# Altium project pca20053.PrjPCB (part 2 of 4)

## Sheet pca20053_sheet5_sensors_and_leds.SchDoc: Thingy:53 Sensors and LEDs
size A3; Organization: Nordic Semiconductor; DocumentNumber: 5; Revision: 1.1.0; SheetNumber: 5; SheetTotal: 6; Author: MASI; CompanyName: Nordic Semiconductor; DrawnBy: MASI; DocumentSize: A3; ProjectName: Thingy:53
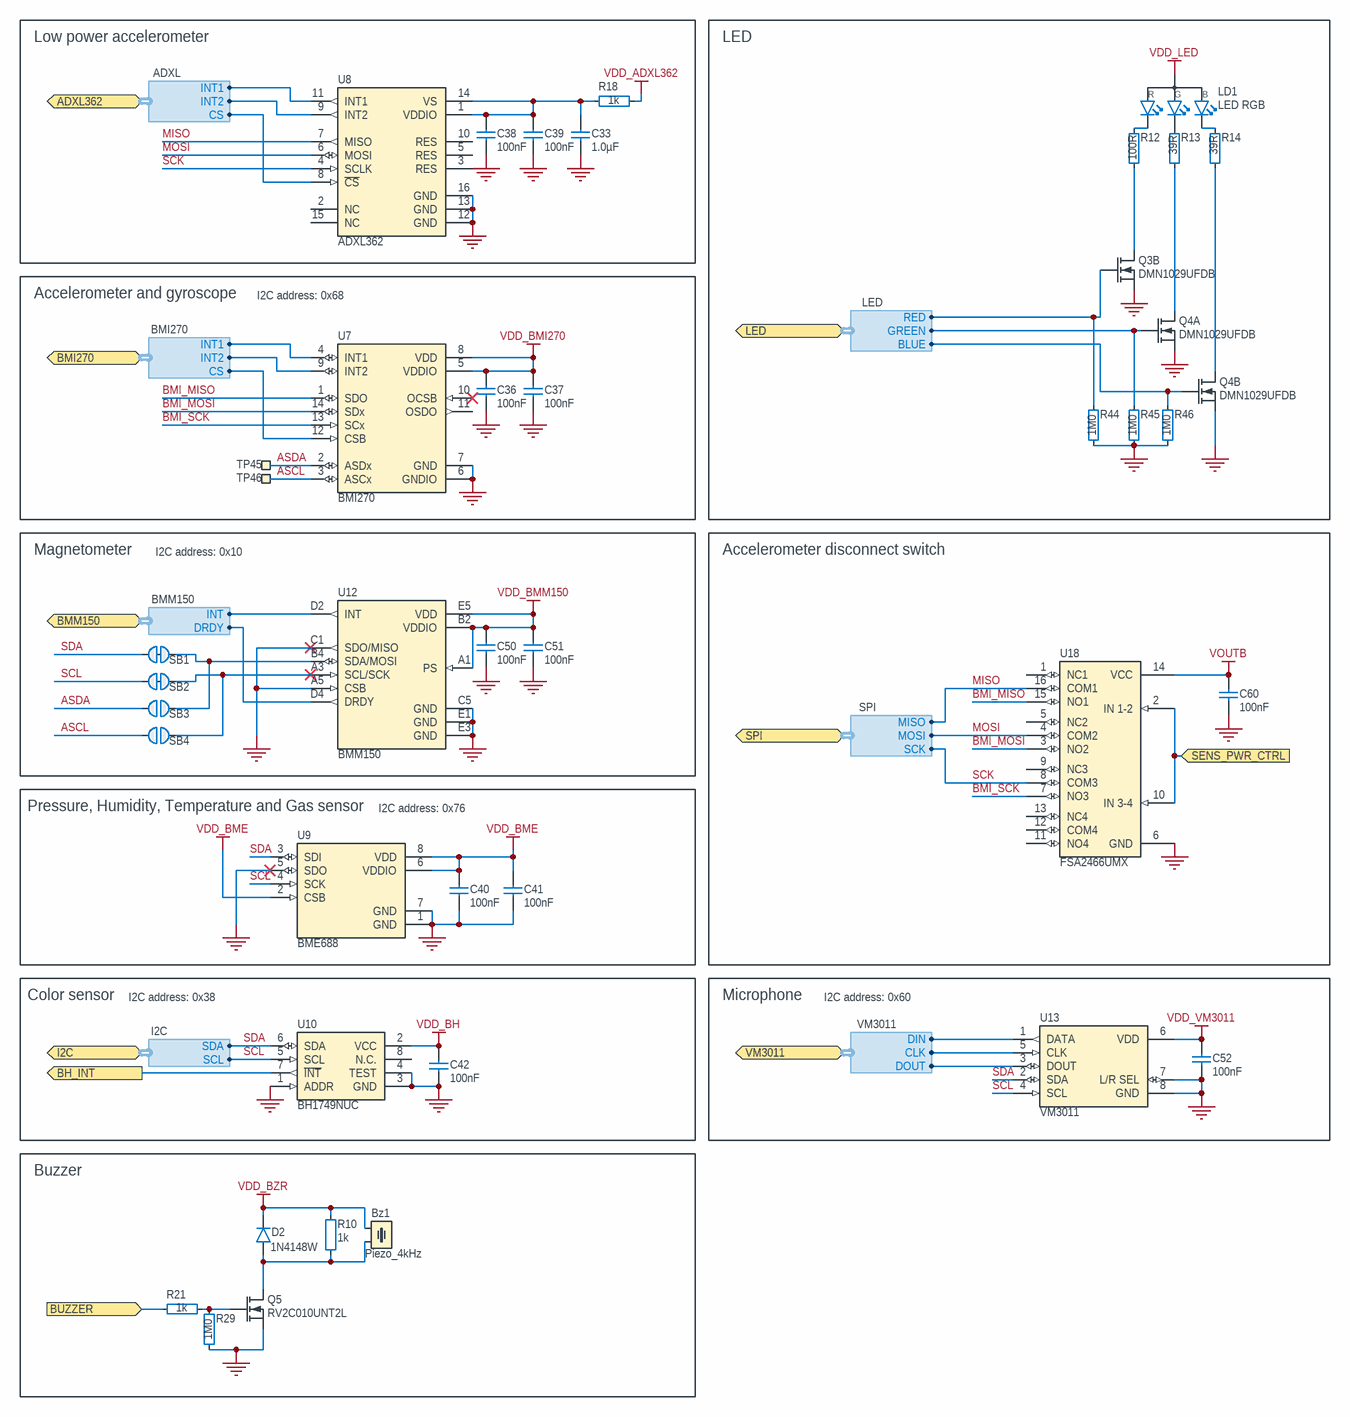
[diagram p2: pca20053_sheet5_sensors_and_leds.SchDoc]

### Parts
Bz1  Piezo_4kHz  [Buzzer_PKMCS0909]
C33  1.0µF  [CAPC1005X04L]
C36  100nF  [CAPC0603X03L_C]
C37  100nF  [CAPC0603X03L_C]
C38  100nF  [CAPC0603X03L_C]
C39  100nF  [CAPC0603X03L_C]
C40  100nF  [CAPC0603X03L_C]
C41  100nF  [CAPC0603X03L_C]
C42  100nF  [CAPC0603X03L_C]
C50  100nF  [CAPC0603X03L_C]
C51  100nF  [CAPC0603X03L_C]
C52  100nF  [CAPC0603X03L_C]
C60  100nF  [CAPC0603X03L_C]
D2  1N4148W  [SOD-123-DIODE]
LD1  LED RGB  [LED_RGB_0606]
Q3  DMN1029UFDB  [DFN65P200X60_HS-6N]  (part B of 2)
Q4  DMN1029UFDB  [DFN65P200X60_HS-6N]  (parts A,B of 2)
Q5  RV2C010UNT2L  [DFN65P100X40-3L]
R10  1k  [RESC0603X03L_C]
R12  100R  [RESC0603X03L_C]
R13  39R  [RESC0603X03L_C]
R14  39R  [RESC0603X03L_C]
R18  1k  [RESC0603X03L_C]
R21  1k  [RESC0603X03L_C]
R29  1M0  [RESC0603X03L_C]
R44  1M0  [RESC0603X03L_C]
R45  1M0  [RESC0603X03L_C]
R46  1M0  [RESC0603X03L_C]
SB1  Solderbridge  [Solderbridge_Shorted]  (value not drawn)  (net tie, no BOM)
SB2  Solderbridge  [Solderbridge_Shorted]  (value not drawn)  (net tie, no BOM)
SB3  Solderbridge  [Solderbridge]  (value not drawn)  (no BOM)
SB4  Solderbridge  [Solderbridge]  (value not drawn)  (no BOM)
TP45  Ø0.7mm,SMD  [TP_SMD_D0.7mm]  (value not drawn)  (no BOM)
TP46  Ø0.7mm,SMD  [TP_SMD_D0.7mm]  (value not drawn)  (no BOM)
U7  BMI270  [BMI270]
U8  ADXL362  [LGA50P322X300X114-16N]
U9  BME688  [BME680]
U10  BH1749NUC  [WSON50P210X210X60_HS-9N]
U12  BMM150  [BMM150]
U13  VM3011  [VM3011]
U18  FSA2466UMX  [XQFN40P180X260X50-16N]

### Blocks framed on the sheet
Low power accelerometer: C33 C38 C39 R18 U8
LED: LD1 Q3 Q4 R12-R14 R44-R46
Accelerometer and gyroscope: C36 C37 TP45 TP46 U7
Magnetometer: C50 C51 SB1-SB4 U12
Accelerometer disconnect switch: C60 U18
Pressure, Humidity, Temperature and Gas sensor: C40 C41 U9
Color sensor: C42 U10
Microphone: C52 U13
Buzzer: Bz1 D2 Q5 R10 R21 R29

### Ports
ADXL362 (bidir, harness ADXL), BH_INT (out), BMI270 (bidir, harness BMI270), BMM150 (bidir, harness BMM150), BUZZER (in), I2C (bidir, harness I2C), LED (bidir, harness LED), SENS_PWR_CTRL (in), SPI (bidir, harness SPI), VM3011 (bidir, harness VM3011)

### Harnesses
I2C: SDA, SCL
LED: BLUE, GREEN, RED
BMI270: CS, INT2, INT1
ADXL: CS, INT2, INT1
BMM150: DRDY, INT
VM3011: DIN, CLK, DOUT
SPI: MISO, MOSI, SCK

### Nets
GND: C33.1 C36.1 C37.1 C38.1 C39.1 C40.1 C41.1 C42.1 C50.1 C51.1 C52.1 C60.2 Q3.4(S2) Q4.1(S1) Q4.4(S2) Q5.2(S) R29.1 R44.1 R45.1 R46.1 U7.6(GNDIO) U7.7(GND) U8.12(GND) U8.13(GND) U8.16(GND) U9.1(GND) U9.5(SDO) U9.7(GND) U10.1(ADDR) U10.3(GND) U10.4(TEST) U10.9(GND) U12.A5(CSB) U12.C1(SDO/MISO) U12.C5(GND) U12.E1(GND) U12.E3(GND) U13.7(L/R_SEL) U13.8(GND) U18.6(GND)
VDD_ADXL362: R18.1
VDD_BH: C42.2 U10.2(VCC)
VDD_BME: C40.2 C41.2 U9.2(CSB) U9.6(VDDIO) U9.8(VDD)
VDD_BMI270: C36.2 C37.2 U7.5(VDDIO) U7.8(VDD)
VDD_BMM150: C50.2 C51.2 U12.A1(PS) U12.B2(VDDIO) U12.E5(VDD)
VDD_BZR: Bz1.1 D2.1(C) R10.2
VDD_LED: LD1.4(A)  [project net 3V3]
VDD_VM3011: C52.2 U13.6(VDD)
VOUTB: C60.1 U18.14(VCC)
ASCL: SB4.1 TP46.1 U7.3(ASCx)
ASDA: SB3.1 TP45.1 U7.2(ASDx)
BMI_MISO: U7.1(SDO) U18.15(NO1)
BMI_MOSI: U7.14(SDx) U18.3(NO2)
BMI_SCK: U7.13(SCx) U18.7(NO3)
MISO: U8.7(MISO) U18.16(COM1) ; port SPI.MISO
MOSI: U8.6(MOSI) U18.4(COM2) ; port SPI.MOSI
P0.19: U8.11(INT1) ; port ADXL362.INT1
P0.20: U12.D2(INT) ; port BMM150.INT
P0.21: U12.D4(DRDY) ; port BMM150.DRDY
P0.22: U8.8(~{CS}) ; port ADXL362.CS
P0.23: U7.4(INT1) ; port BMI270.INT1
P0.25/AIN4: U13.3(DOUT) ; port VM3011.DOUT
P0.27/AIN6: U13.1(DATA) ; port VM3011.DIN
P0.31: U18.2(IN_1-2) U18.10(IN_3-4) ; port SENS_PWR_CTRL
P1.04: U7.12(CSB) ; port BMI270.CS
P1.05: U10.7(~{INT}) ; port BH_INT
P1.06: Q4.2(G1) R45.2 ; port LED.GREEN
P1.07: Q4.5(G2) R46.2 ; port LED.BLUE
P1.08: Q3.5(G2) R44.2 ; port LED.RED
P1.09: U13.5(CLK) ; port VM3011.CLK
P1.15: R21.1 ; port BUZZER
SCK: U8.4(SCLK) U18.8(COM3) ; port SPI.SCK  [project net P0.29]
SCL: SB2.2 U9.4(SCK) U10.5(SCL) U13.4(SCL) ; port I2C.SCL  [project net P1.03]
SDA: SB1.2 U9.3(SDI) U10.6(SDA) U13.2(SDA) ; port I2C.SDA  [project net P1.02]
NetBz1_2: Bz1.2 D2.2(A) Q5.3(D) R10.1
NetC33_2: C33.2 C38.2 C39.2 R18.2 U8.1(VDDIO) U8.14(VS)
NetLD1_1: LD1.1(C_RED) R12.2
NetLD1_2: LD1.2(C_GREEN) R13.2
NetLD1_3: LD1.3(C_BLUE) R14.2
NetQ3_3: Q3.3(D2) R12.1
NetQ4_3: Q4.3(D2) R14.1
NetQ4_6: Q4.6(D1) R13.1
NetQ5_1: Q5.1(G) R21.2 R29.2
NetSB1_1: SB1.1 SB3.2 U12.B4(SDA/MOSI)
NetSB2_1: SB2.1 SB4.2 U12.A3(SCL/SCK)
NetU7_9: U7.9(INT2) ; port BMI270.INT2
NetU8_9: U8.9(INT2) ; port ADXL362.INT2

Not connected (* = marked no-connect by the designer): U7 10(OCSB)* 11(OSDO); U8 2(NC) 3(RES) 5(RES) 10(RES) 15(NC); U10 8(N.C.); U18 1(NC1) 5(NC2) 9(NC3) 11(NO4) 12(COM4) 13(NC4)

### Notes on the sheet
- I2C address: 0x68
- I2C address: 0x10
- (near U9) I2C address: 0x76
- I2C address: 0x38
- I2C address: 0x60
- Title
- Size
- Date:
- File:
- A3
- PCB Assembly Number
- Sheet         of
- Drawn By:
- Revision
- Classification:
- (in symbol LTST-C19HE1WT) R; G; B

### Library data of the parts
Bz1 = PKMCS0909E4000-R1: Piezo Buzzer, SMD, 9.0mm x 9.0mm x 1.9mm, 4kHz, 65dB @ 1.5V, <12.5Vp-p; Manufacturer: Murata; Part number NEMS: 101000026; Note: 1.5 ~ 12.5V; Artikkelnr Noca: N.A.; Pad Count: 2; Component Status: Active; Part Number: PKMCS0909E4000-R1; Manufacturer Part Number: PKMCS0909E4000-R1; ComponentLink1URL: N.A.; ComponentLink1Description: Datasheet; ComponentLink2URL: N.A.; ComponentLink2Description: Supplier link; HelpURL: https://www.murata.com/en-global/products/productdetail.aspx?partno=PKMCS0909E4000-R1; Footprint Doc: Buzzer_PKMCS0909; LatestRevisionDate: 2020-08-04; Published: 2020-08-04; Value: Piezo_4kHz; Supplier 1: Digi-Key; Supplier Part Number 1: 490-9647-1-ND; Supplier 2: Mouser; Supplier Part Number 2: 81-PKMCS0909E4000-R1; Part number IPS: N.A.; Component Class: Transducers; PartId: 101000026; Author: rsk; Part number Norautron: N.A.
C33 = C0402-1µ0-25V-X5R: Capacitor, Ceramic, X5R, ±10%, 25V; Manufacturer: Murata; Manufacturer Part Number: GRM155R61E105KA12D; Part number NEMS: 100200453; Artikkelnr Noca: N.A.; Pad Count: 2; Component Status: Active; Part Number: C0402-1µ0-25V-X5R; LatestRevisionDate: 2020-12-16; Published: 2020-12-16; Value: 1.0µF; Footprint Doc: 0402; Component Class: Capacitors; ComponentLink1Description: Datasheet; ComponentLink1URL: https://search.murata.co.jp/Ceramy/image/img/A01X/G101/ENG/GRM155R61E105KA12-01.pdf; ComponentLink2Description: Supplier link; ComponentLink2URL: https://www.murata.com/en-global/products/productdetail?partno=GRM155R61E105KA12%23; HelpURL: N.A.; Note: 25V; PartId: 100200453; Part number IPS: N.A.; Supplier 1: Digi-Key; Supplier 2: Mouser; Supplier Part Number 1: 490-10017-1-ND; Supplier Part Number 2: 81-GRM155R61E105KA2D; Author: rsk; Part number Norautron: N.A.
C36-C42 C50-C52 C60 = C0201-100n-6.3V-X5R: Capacitor, Ceramic, X5R, ±10%, 6.3V; Manufacturer: Murata; Manufacturer Part Number: GRM033R60J104KE19D; Part number NEMS: 100200451; Artikkelnr Noca: N.A.; Pad Count: 2; Component Status: Active; Part Number: C0201-100n-6.3V-X5R; Footprint Doc: 0201; LatestRevisionDate: 2020-12-15; Published: 2020-12-15; Value: 100nF; Note: 6.3V; Part number IPS: N.A.; ComponentLink1URL: https://search.murata.co.jp/Ceramy/image/img/A01X/G101/ENG/GRM033R60J104KE19-01.pdf; ComponentLink1Description: Datasheet; ComponentLink2URL: https://www.murata.com/en-eu/products/productdetail?partno=GRM033R60J104KE19%23; ComponentLink2Description: Supplier link; HelpURL: N.A.; Supplier 1: Digi-Key; Supplier Part Number 1: 490-3167-1-ND; Supplier 2: N.A.; Supplier Part Number 2: N.A.; Component Class: Capacitors; PartId: 100200451; Author: rsk; Part number Norautron: N.A.
D2 = 1N4148W: 1N4148, Small Signal Fast Switching Diode; Manufacturer: Vishay; Manufacturer Part Number: 1N4148W-E3-08; Part number IPS: 00000001783; Part number NEMS: 101300078; Artikkelnr Noca: N.A.; Pad Count: 2; Component Status: Active; Part Number: 1N4148W; ComponentLink1URL: N.A.; ComponentLink1Description: Datasheet; ComponentLink2URL: N.A.; ComponentLink2Description: Supplier link; HelpURL: http://www.vishay.com/docs/85748/1n4148w.pdf; Footprint Doc: SOD-123; LatestRevisionDate: 2016-01-12; Published: 2011-04-21; Value: 1N4148W; Note: Small Signal Fast Switching Diode; Supplier 1: Farnell; Supplier Part Number 1: 237-7282; Supplier 2: Digi-Key; Supplier Part Number 2: 1N4148W-E3-08CT-ND; Component Class: Semiconductors; PartId: 101300078; Author: rsk; Part number Norautron: N.A.
LD1 = LTST-C19HE1WT: RGB LED 1.60 mm x 1.60 mm SMD; Manufacturer: LITEON; Part number IPS: 00000007798; Part number NEMS: 101400093; Note: N.A.; Pad Count: 4; Component Status: Active; Part Number: LTST-C19HE1WT; Manufacturer Part Number: LTST-C19HE1WT; LatestRevisionDate: 2016-09-23; Published: 2016-09-23; Value: LED RGB; Artikkelnr Noca: N.A.; Footprint Doc: LED_RGB_0606; ComponentLink1URL: N.A.; ComponentLink1Description: Datasheet; ComponentLink2URL: N.A.; ComponentLink2Description: Supplier link; HelpURL: http://optoelectronics.liteon.com/upload/download/DS22-2008-0044/S_110_LTST-C19HE1WT.pdf; Supplier 1: Digi-Key; Supplier Part Number 1: 160-2162-1-ND; Supplier 2: Mouser; Supplier Part Number 2: 859-LTST-C19HE1WT; Component Class: Optoelectronics; PartId: 101400093; Author: rsk; Part number Norautron: N.A.
Q3 Q4 = DMN1029UFDB: Dual N Ch MOFET, 5.6A, 29mOhm @ 5A, 4.5V, 1.4W; Manufacturer: Diodes Incorporated; Manufacturer Part Number: DMN1029UFDB-7; Part number NEMS: 101300175; Note: N.A.; Pad Count: 6; Component Status: Active; Part Number: DMN1029UFDB; Footprint Doc: DFN-6; LatestRevisionDate: 2020-04-29; Published: 2020-04-29; Value: DMN1029UFDB; Artikkelnr Noca: N.A.; Part number IPS: N.A.; Supplier 1: Digi-Key; Supplier Part Number 1: DMN1029UFDB-7DICT-ND; Supplier 2: Mouser; Supplier Part Number 2: 621-DMN1029UFDB-7; ComponentLink1URL: https://www.diodes.com/assets/Datasheets/DMN1029UFDB.pdf; ComponentLink1Description: Datasheet; ComponentLink2URL: N.A.; ComponentLink2Description: Supplier link; HelpURL: https://www.diodes.com/assets/Datasheets/DMN1029UFDB.pdf; Component Class: Semiconductors; PartId: 101300175; Author: rsk; Part number Norautron: N.A.
Q5 = RV2C010UNT2L: N-Channel MOSFET, 20V, 1A, 470mOhm, 400mW; Manufacturer: Rohm Semiconductor; Part number IPS: 00000009976; Part number Norautron: 26320026; Part number NEMS: 101300132; Note: N.A.; Artikkelnr Noca: 35010020; Pad Count: 3; Component Status: Active; Part Number: RV2C010UNT2L; Manufacturer Part Number: RV2C010UNT2L; Footprint Doc: DFN-3; LatestRevisionDate: 2016-08-09; Published: 2016-08-09; Value: RV2C010UNT2L; ComponentLink1URL: N.A.; ComponentLink1Description: Datasheet; ComponentLink2URL: N.A.; ComponentLink2Description: Supplier link; HelpURL: http://rohmfs.rohm.com/en/products/databook/datasheet/discrete/transistor/mosfet/rv2c010unt2l-e.pdf; Supplier 1: Digi-Key; Supplier Part Number 1: RV2C010UNT2LCT-ND; Supplier 2: Mouser; Supplier Part Number 2: 755-RV2C010UNT2L; Component Class: Semiconductors; PartId: 101300132; Author: rsk
R10 R18 R21 = R0201-1k0: Resistor, ±1%, 0.05W; Manufacturer: N.A.; Part number IPS: 00000005786; Part number NEMS: 100100043; Note: Chip Res 1%; Pad Count: 2; Component Status: Active; Part Number: R0201-1k0; Manufacturer Part Number: N.A.; ComponentLink1URL: N.A.; ComponentLink1Description: Datasheet; ComponentLink2URL: N.A.; ComponentLink2Description: Supplier link; HelpURL: N.A.; Footprint Doc: 0201; LatestRevisionDate: 2014-11-13; Published: 2014-11-13; Value: 1k; Supplier 1: N.A.; Supplier Part Number 1: N.A.; Supplier 2: N.A.; Supplier Part Number 2: N.A.; Artikkelnr Noca: N.A.; Component Class: Resistors; PartId: 100100043; Author: rsk; Part number Norautron: N.A.
R12 = R0201-100: Resistor, ±1%, 0.05W; Manufacturer: N.A.; Part number IPS: 00000001794; Part number Norautron: 26107004; Part number NEMS: 100100027; Note: Chip Res 1%; Pad Count: 2; Component Status: Active; Part Number: R0201-100; Manufacturer Part Number: N.A.; LatestRevisionDate: 2014-11-13; Published: 2014-11-13; Value: 100R; Artikkelnr Noca: N.A.; Footprint Doc: 0201; ComponentLink1URL: N.A.; ComponentLink1Description: Datasheet; ComponentLink2URL: N.A.; ComponentLink2Description: Supplier link; HelpURL: N.A.; Supplier 1: N.A.; Supplier Part Number 1: N.A.; Supplier 2: N.A.; Supplier Part Number 2: N.A.; Component Class: Resistors; PartId: 100100027; Author: rsk
R13 R14 = R0201-39R: Resistor, ±1%, 0.05W; Manufacturer: N.A.; Part number IPS: 00000001704; Part number NEMS: 100100021; Note: Chip Res 1%; Pad Count: 2; Component Status: Active; Part Number: R0201-39R; Manufacturer Part Number: N.A.; LatestRevisionDate: 2014-11-13; Published: 2014-11-13; Value: 39R; Artikkelnr Noca: N.A.; Footprint Doc: 0201; ComponentLink1URL: N.A.; ComponentLink1Description: Datasheet; ComponentLink2URL: N.A.; ComponentLink2Description: Supplier link; HelpURL: N.A.; Supplier 1: N.A.; Supplier Part Number 1: N.A.; Supplier 2: N.A.; Supplier Part Number 2: N.A.; Component Class: Resistors; PartId: 100100021; Author: rsk; Part number Norautron: N.A.
R29 = R0201-1M0: Resistor, ±1%, 0.05W; Manufacturer: N.A.; Part number IPS: 00000001418; Part number Norautron: 26107108; Part number NEMS: 100100093; Pad Count: 2; Note: Chip Res 1%; Component Status: Active; Part Number: R0201-1M0; PartId: 100100093; Component Class: Resistors; Manufacturer Part Number: N.A.; ComponentLink1URL: N.A.; ComponentLink1Description: Datasheet; ComponentLink2URL: N.A.; ComponentLink2Description: Supplier link; HelpURL: N.A.; Footprint Doc: 0201; LatestRevisionDate: 2014-11-13; Published: 2014-11-13; Value: 1M0; Supplier 1: N.A.; Supplier Part Number 1: N.A.; Supplier 2: N.A.; Supplier Part Number 2: N.A.; Artikkelnr Noca: N.A.; Author: rsk
R44-R46 = R0201-1M0: Resistor, ±1%, 0.05W; Manufacturer: N.A.; Part number IPS: 00000001418; Part number Norautron: 26107108; Part number NEMS: 100100093; Note: Chip Res 1%; Pad Count: 2; Component Status: Active; Part Number: R0201-1M0; Manufacturer Part Number: N.A.; LatestRevisionDate: 2014-11-13; Published: 2014-11-13; Value: 1M0; Artikkelnr Noca: N.A.; Footprint Doc: 0201; ComponentLink1URL: N.A.; ComponentLink1Description: Datasheet; ComponentLink2URL: N.A.; ComponentLink2Description: Supplier link; HelpURL: N.A.; Supplier 1: N.A.; Supplier Part Number 1: N.A.; Supplier 2: N.A.; Supplier Part Number 2: N.A.; Component Class: Resistors; PartId: 100100093; Author: rsk
SB1 SB2 = Solderbridge Shorted: Shorted Solderbridge; Manufacturer: N.A.; Part number NEMS: 100500459; Pad Count: 2; Component Status: Active; System: Connector; Part Number: Solderbridge Shorted; PartId: 100500459; Component Class: Connectors; Manufacturer Part Number: N.A.; ComponentLink1URL: N.A.; ComponentLink1Description: Datasheet; ComponentLink2URL: N.A.; ComponentLink2Description: Supplier link; HelpURL: N.A.; Footprint Doc: Solderbridge_Shorted; LatestRevisionDate: 2012-08-07; Published: 2012-08-07; Value: Solderbridge; Note: N.A.; Supplier 1: N.A.; Supplier Part Number 1: N.A.; Supplier 2: N.A.; Supplier Part Number 2: N.A.; Artikkelnr Noca: N.A.; Part number IPS: N.A.; Author: rsk; Part number Norautron: N.A.
SB3 SB4 = Solderbridge: Manufacturer: N.A.; Part number NEMS: 100500458; Pad Count: 2; Component Status: Active; System: Connector; Part Number: Solderbridge; PartId: 100500458; Component Class: Connectors; Manufacturer Part Number: N.A.; ComponentLink1URL: N.A.; ComponentLink1Description: Datasheet; ComponentLink2URL: N.A.; ComponentLink2Description: Supplier link; HelpURL: N.A.; Footprint Doc: Solderbridge; LatestRevisionDate: 2009-12-14; Published: 2009-12-14; Value: Solderbridge; Note: N.A.; Supplier 1: N.A.; Supplier Part Number 1: N.A.; Supplier 2: N.A.; Supplier Part Number 2: N.A.; Artikkelnr Noca: N.A.; Part number IPS: N.A.; Author: rsk; Part number Norautron: N.A.
TP45 TP46 = TP_SMD_Ø0.7MM: 0.7mm circular SMD testpad; Manufacturer: Nordic Semiconductor; Manufacturer Part Number: N.A.; Part number NEMS: 100500474; Pad Count: 1; Component Status: Active; System: Connector; Part Number: TP_SMD_Ø0.7MM; PartId: 100500474; Component Class: Connectors; ComponentLink1URL: N.A.; ComponentLink1Description: Datasheet; ComponentLink2URL: N.A.; ComponentLink2Description: Supplier link; HelpURL: N.A.; Footprint Doc: TP_SMD_Ø0.7mm; LatestRevisionDate: 2021-03-05; Published: 2017-12-14; Value: Ø0.7mm,SMD; Note: N.A.; Supplier 1: N.A.; Supplier Part Number 1: N.A.; Supplier 2: N.A.; Supplier Part Number 2: N.A.; Artikkelnr Noca: N.A.; Part number IPS: N.A.; Author: rsk; Part number Norautron: N.A.
U7 = BMI270: 6-axis, smart, low-power, inertial measurement unit; Manufacturer: Bosch; Part number NEMS: 101900620; Note: N.A.; Pad Count: 14; Component Status: Active; Part Number: BMI270; Manufacturer Part Number: BMI270; ComponentLink1URL: https://www.bosch-sensortec.com/media/boschsensortec/downloads/datasheets/bst-bmi270-ds000.pdf; ComponentLink1Description: Datasheet; ComponentLink2URL: https://www.bosch-sensortec.com/products/motion-sensors/imus/bmi270.html; ComponentLink2Description: Supplier link; HelpURL: https://www.bosch-sensortec.com/media/boschsensortec/downloads/datasheets/bst-bmi270-ds000.pdf; Footprint Doc: LGA-14; LatestRevisionDate: 2021-08-03; Published: 2020-07-07; Value: BMI270; Supplier 1: Digi-Key; Supplier Part Number 1: 828-1091-1-ND; Supplier 2: Mouser; Supplier Part Number 2: 262-BMI270; Artikkelnr Noca: N.A.; Part number IPS: N.A.; Component Class: Misc_ICs; PartId: 101900620; Author: rsk; Part number Norautron: N.A.
U8 = ADXL362: Micropower, 3-Axis, ±2 g/±4 g/±8 g Digital Output MEMS Accelerometer; Manufacturer: Analog Devices; Part number IPS: 00000001799; Part number NEMS: 101900573; Note: N.A.; Pad Count: 16; Component Status: Active; Part Number: ADXL362; Manufacturer Part Number: ADXL362; ComponentLink1URL: http://www.analog.com/media/en/technical-documentation/data-sheets/ADXL362.pdf; ComponentLink1Description: Datasheet; ComponentLink2URL: http://www.analog.com/en/products/adxl362.html; ComponentLink2Description: Supplier link; HelpURL: https://www.analog.com/media/en/technical-documentation/data-sheets/ADXL362.pdf; Footprint Doc: LGA-16; LatestRevisionDate: 2019-01-11; Published: 2019-01-11; Value: ADXL362; Supplier 1: Digi-Key; Supplier Part Number 1: ADXL362BCCZ-RL7CT-ND; Supplier 2: Mouser; Supplier Part Number 2: 584-ADXL362BCCZ-R7; Artikkelnr Noca: N.A.; Component Class: Misc_ICs; PartId: 101900573; Author: rsk; Part number Norautron: N.A.
U9 = BME688: Low power gas, pressure, temperature & humidity sensor; Manufacturer: Bosch; Part number NEMS: 101900619; Note: N.A.; Pad Count: 8; Component Status: Active; Part Number: BME688; Manufacturer Part Number: BME688; Footprint Doc: LGA-8; LatestRevisionDate: 2020-07-07; Published: 2020-07-07; Value: BME688; Artikkelnr Noca: N.A.; Part number IPS: N.A.; ComponentLink1URL: https://ae-bst.resource.bosch.com/media/_tech/media/datasheets/BST-BME680-DS001-00.pdf; ComponentLink1Description: Datasheet; ComponentLink2Description: Supplier link; HelpURL: N.A.; Supplier 1: Digi-Key; Supplier Part Number 1: N.A.; Supplier 2: N.A.; Supplier Part Number 2: N.A.; Component Class: Misc_ICs; ComponentLink2URL: N.A.; PartId: 101900619; Author: rsk; Part number Norautron: N.A.
U10 = BH1749NUC: Digital 16bit Serial Output Type Color Sensor IC; Manufacturer: Rohm Semiconductor; Part number IPS: 00000001801; Part number NEMS: 101900572; Note: N.A.; Pad Count: 8; Component Status: Active; Part Number: BH1749NUC; Manufacturer Part Number: BH1749NUC; Footprint Doc: WSON-8; LatestRevisionDate: 2019-01-11; Published: 2019-01-11; Value: BH1749NUC; Artikkelnr Noca: N.A.; ComponentLink1URL: N.A.; ComponentLink1Description: Datasheet; ComponentLink2URL: N.A.; ComponentLink2Description: Supplier link; HelpURL: https://www.rohm.com/datasheet/BH1749NUC/bh1749nuc-e; Supplier 1: Digi-Key; Supplier Part Number 1: BH1749NUC-E2CT-ND; Supplier 2: Mouser; Supplier Part Number 2: 755-BH1749NUC-E2; Component Class: Misc_ICs; PartId: 101900572; Author: rsk; Part number Norautron: N.A.
U12 = BMM150: 3-axis geomagnetic sensor; Manufacturer: Bosch; Part number NEMS: 101900621; Note: N.A.; Pad Count: 12; Component Status: Active; Part Number: BMM150; Manufacturer Part Number: BMM150; ComponentLink1URL: https://www.bosch-sensortec.com/media/boschsensortec/downloads/datasheets/bst-bmm150-ds001.pdf; ComponentLink1Description: Datasheet; ComponentLink2URL: https://www.bosch-sensortec.com/products/motion-sensors/magnetometers-bmm150/; ComponentLink2Description: Supplier link; HelpURL: https://www.bosch-sensortec.com/media/boschsensortec/downloads/datasheets/bst-bmm150-ds001.pdf; Footprint Doc: WLCSP-12; LatestRevisionDate: 2020-07-07; Published: 2020-07-07; Value: BMM150; Supplier 1: Digi-Key; Supplier Part Number 1: 828-1044-1-ND; Supplier 2: Mouser; Supplier Part Number 2: 262-BMM150; Artikkelnr Noca: N.A.; Part number IPS: N.A.; Component Class: Misc_ICs; PartId: 101900621; Author: rsk; Part number Norautron: N.A.
U13 = VM3011AB: Low-Noise PDM Digital Piezoelectric MEMS Microphone with ZeroPower Listening; Manufacturer: Vesper; Part number Norautron: 26470039; Part number NEMS: 101900623; Component Status: Active; Pad Count: 8; Note: N.A.; Part Number: VM3011AB; PartId: 101900768; Component Class: Misc_ICs; Author: rsk; Manufacturer Part Number: VM3011AB; ComponentLink1URL: N.A.; ComponentLink1Description: Datasheet; ComponentLink2URL: N.A.; ComponentLink2Description: Supplier link; HelpURL: N.A.; LatestRevisionDate: 2022-02-02; Published: 2020-02-02; Footprint Doc: VM3011; Value: VM3011; Supplier 1: Digi-Key; Supplier Part Number 1: N.A.; Supplier 2: N.A.; Supplier Part Number 2: N.A.; Artikkelnr Noca: N.A.; Part number IPS: N.A.
U18 = FSA2466UMX: Data / Audio Low-Voltage Dual DPDT Analog Switch; Manufacturer: ON Semiconductor; Part number IPS: 00000009986; Part number Norautron: 26500608; Part number NEMS: 101900422; Note: N.A.; Artikkelnr Noca: 15070069; Pad Count: 16; Component Status: Active; Part Number: FSA2466UMX; Manufacturer Part Number: FSA2466UMX; ComponentLink1URL: N.A.; ComponentLink1Description: Datasheet; ComponentLink2URL: N.A.; ComponentLink2Description: Supplier link; HelpURL: https://www.onsemi.com/pub/Collateral/FSA2466-D.PDF; Footprint Doc: UFQFN-16; LatestRevisionDate: 2019-05-15; Published: 2016-05-18; Value: FSA2466UMX; Supplier 1: Digi-Key; Supplier Part Number 1: FSA2466UMXCT-ND; Supplier 2: Mouser; Supplier Part Number 2: 512-FSA2466UMX; Component Class: Misc_ICs; PartId: 101900422; Author: rsk

## Sheet pca20053_sheet3_nRF21540_FEM.SchDoc: Thingy:53 nRF21540 Front-end module
size A3; Organization: Nordic Semiconductor; DocumentNumber: 3; Revision: 1.1.0; SheetNumber: 3; SheetTotal: 6; Author: MASI; CompanyName: Nordic Semiconductor; DrawnBy: MASI; DocumentSize: A3; ProjectName: Thingy:53
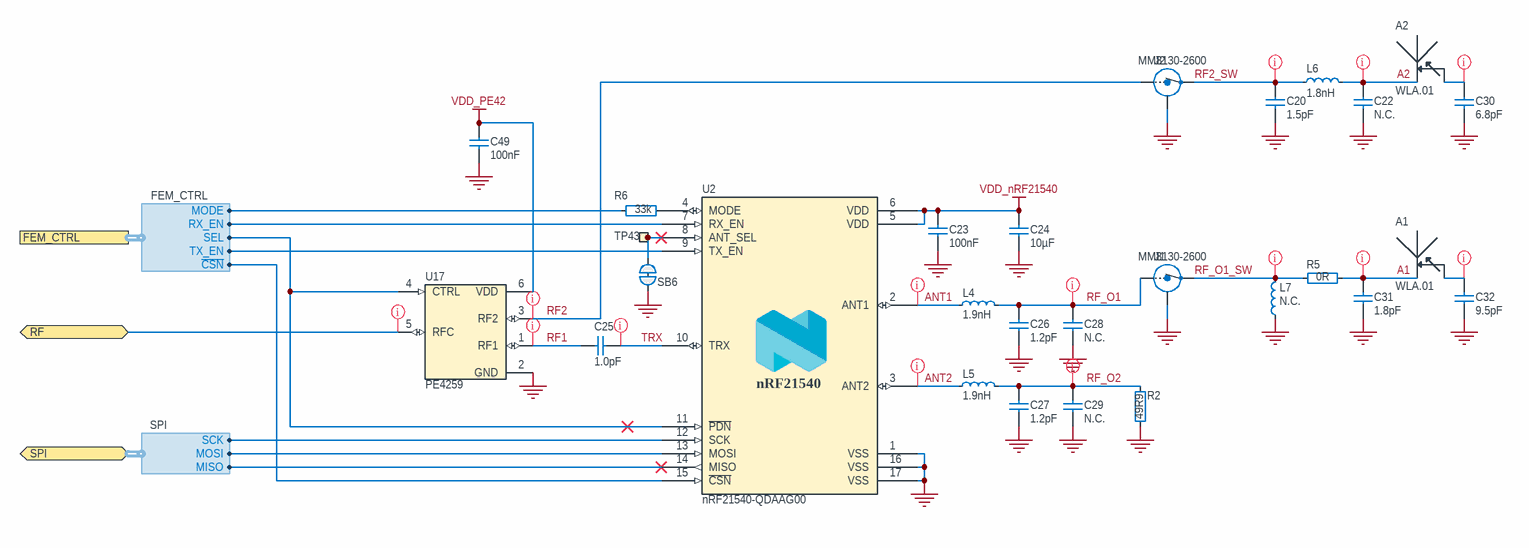
[diagram p3: pca20053_sheet3_nRF21540_FEM.SchDoc]

### Parts
A1  WLA.01  [WLA.01]
A2  WLA.01  [WLA.01]
C20  1.5pF  [CAPC0603X03L_C]
C22  N.C.  [CAPC0603X03L_C_NC]
C23  100nF  [CAPC0603X03L_C]
C24  10µF  [CAPC1608X06L]
C25  1.0pF  [CAPC0603X03L_C]
C26  1.2pF  [CAPC0603X03L_C]
C27  1.2pF  [CAPC0603X03L_C]
C28  N.C.  [CAPC0603X03L_C_NC]
C29  N.C.  [CAPC0603X03L_C_NC]
C30  6.8pF  [CAPC0603X03L_C]
C31  1.8pF  [CAPC0603X03L_C]
C32  9.5pF  [CAPC0603X03L_C]
C49  100nF  [CAPC0603X03L_C]
J1  MM8130-2600  [COAXIAL-SWF]
J2  MM8130-2600  [COAXIAL-SWF]
L4  1.9nH  [INDC0603X03L_C]
L5  1.9nH  [INDC0603X03L_C]
L6  1.8nH  [INDC0603X03L_C]
L7  N.C.  [INDC0603X03L_C_NC]
R2  49R9  [RESC1005X04L]
R5  0R  [RESC0603X03L_C]
R6  33k  [RESC0603X03L_C]
SB6  Solderbridge  [Solderbridge_Shorted]  (value not drawn)  (net tie, no BOM)
TP43  Ø1.5mm,SMD  [TP_SMD_D1.5mm]  (value not drawn)  (no BOM)
U2  nRF21540-QDAAG00  [QFN65P400X400X65_HS-17N]
U17  PE4259  [SOT65P210X100-6N]

### Ports
FEM_CTRL (harness FEM_CTRL), RF (bidir), SPI (bidir, harness SPI)

### Harnesses
SPI: MISO, MOSI, SCK
FEM_CTRL: MODE, RX_EN, SEL, TX_EN, ~{CSN}

### Nets
GND: A1.2(GND) A2.2(GND) C20.1 C22.1 C23.1 C24.1 C26.1 C27.1 C28.1 C29.1 C30.2 C31.1 C32.2 C49.1 J1.2(Shield) J2.2(Shield) L7.1 R2.1 SB6.2 U2.1(VSS) U2.16(VSS) U2.17(VSS) U17.2(GND)
VDD_nRF21540: C23.2 C24.2 U2.5(VDD) U2.6(VDD)
VDD_PE42: C49.2 U17.6(VDD)
A1: A1.1 C31.2 R5.2
A2: A2.1 C22.2 L6.2
ANT1: L4.1 U2.2(ANT1)
ANT2: L5.1 U2.3(ANT2)
MISO: U2.14(MISO) ; port SPI.MISO
MOSI: U2.13(MOSI) ; port SPI.MOSI
P0.24: U2.15(~{CSN}) ; port FEM_CTRL.~{CSN}
P0.29: U2.12(SCK) ; port SPI.SCK
P0.30: U2.9(TX_EN) ; port FEM_CTRL.TX_EN
P1.10: U2.11(~{PDN}) U17.4(CTRL) ; port FEM_CTRL.SEL
P1.11: U2.7(RX_EN) ; port FEM_CTRL.RX_EN
P1.12: R6.1 ; port FEM_CTRL.MODE
RF: U17.5(RFC) ; port RF
RF1: C25.1 U17.1(RF1)
RF2: J2.1(IN) U17.3(RF2)
RF2_SW: C20.2 J2.3(OUT) L6.1
RF_O1: C26.2 C28.2 J1.1(IN) L4.2
RF_O1_SW: J1.3(OUT) L7.2 R5.1
RF_O2: C27.2 C29.2 L5.2 R2.2
TRX: C25.2 U2.10(TRX)
NetA1_3: A1.3(Tuning) C32.1
NetA2_3: A2.3(Tuning) C30.1
NetR6_2: R6.2 U2.4(MODE)
NetSB6_1: SB6.1 TP43.1 U2.8(ANT_SEL)

### Layout directives
net class RF: A1, A2, ANT1, ANT2, NetA1_3, NetA2_3, RF, RF1, RF2, RF2_SW, RF_O1, RF_O1_SW, RF_O2, TRX

### Notes on the sheet
- Title
- Size
- Date:
- File:
- A3
- PCB Assembly Number
- Sheet         of
- Drawn By:
- Revision
- Classification:
- (in symbol nRF21540-QDAAG0) nRF21540

### Library data of the parts
A1 A2 = WLA.01: 2.4GHz Ceramic SMD Loop Antenna; Manufacturer: Taoglas; Part number NEMS: 100700063; Note: N.A.; Pad Count: 3; Component Status: Active; Part Number: WLA.01; Manufacturer Part Number: WLA.01; ComponentLink1URL: https://cdn3.taoglas.com/datasheets/WLA.01.pdf; ComponentLink1Description: Datasheet; ComponentLink2URL: https://www.digikey.com/product-detail/en/taoglas-limited/WLA-01/931-1077-1-ND/2332742; ComponentLink2Description: Supplier link; HelpURL: https://www.taoglas.com/product/wla-01-2-42-5ghz-ceramic-loop-antenna-3-21-60-5mm-linear-polarized/; Footprint Doc: WLA.01; LatestRevisionDate: 2020-03-23; Published: 2020-03-23; Value: WLA.01; Supplier 1: Digi-Key; Supplier Part Number 1: 931-1077-1-ND; Supplier 2: N.A.; Supplier Part Number 2: N.A.; Artikkelnr Noca: N.A.; Part number IPS: N.A.; Component Class: Antennas; PartId: 100700063; Author: rsk; Part number Norautron: N.A.
C20 = C0201-1.5p-25V-NP0-GJM0335C1E1R5WB01: Capacitor, NP0, ±0.05pF, 25V, High Q; Manufacturer: Murata; Part number NEMS: 100200477; Pad Count: 2; Artikkelnr Noca: N.A.; Component Status: Active; Part Number: C0201-1.5p-25V-NP0-GJM0335C1E1R5WB01; PartId: 100200477; Component Class: Capacitors; Author: masi; Manufacturer Part Number: GJM0335C1E1R5WB01; ComponentLink1URL: https://search.murata.co.jp/Ceramy/image/img/A01X/G101/ENG/GJM0335C1E1R5WB01-01.pdf; ComponentLink1Description: Datasheet; ComponentLink2URL: N.A.; ComponentLink2Description: Supplier link; HelpURL: https://www.murata.com/products/productdetail?partno=GJM0335C1E1R5WB01%23; Footprint Doc: 0201; LatestRevisionDate: 2021-06-15; Published: 2021-06-15; Value: 1.5pF; Note: 25V; Supplier 1: Digi-Key; Supplier Part Number 1: 490-11176-2-ND; Supplier 2: Mouser; Supplier Part Number 2: 81-GJM0335C1E1R5WB1D; Part number IPS: N.A.; Part number Norautron: N.A.
C22 C28 C29 = C0201-N.C.: Not mounted; Manufacturer: N.A.; Part number NEMS: 100200001; Assembly: Not mounted; Note: Chip Cap; Pad Count: 2; Component Status: Active; Part Number: C0201-N.C.; Manufacturer Part Number: N.A.; ComponentLink1URL: N.A.; ComponentLink1Description: Datasheet; ComponentLink2URL: N.A.; ComponentLink2Description: Supplier link; HelpURL: N.A.; Footprint Doc: 0201; LatestRevisionDate: 2014-11-13; Published: 2014-11-13; Value: N.C.; Supplier 1: N.A.; Supplier Part Number 1: N.A.; Supplier 2: N.A.; Supplier Part Number 2: N.A.; Artikkelnr Noca: N.A.; Part number IPS: N.A.; Component Class: Capacitors; PartId: 100200001; Author: rsk; Part number Norautron: N.A.
C23 C49 = C0201-100n-6.3V-X5R: as C36 on sheet pca20053_sheet5_sensors_and_leds; Part Number: C0201-100n-6.3V-X5R; ComponentLink1URL: https://search.murata.co.jp/Ceramy/image/img/A01X/G101/ENG/GRM033R60J104KE19-01.pdf; ComponentLink1Description: Datasheet; ComponentLink2URL: https://www.murata.com/en-eu/products/productdetail?partno=GRM033R60J104KE19%23; ComponentLink2Description: Supplier link; HelpURL: N.A.; Footprint Doc: 0201; LatestRevisionDate: 2020-12-15; Published: 2020-12-15; Value: 100nF; Note: 6.3V; Part number IPS: N.A.; Supplier 1: Digi-Key; Supplier Part Number 1: 490-3167-1-ND; Supplier 2: N.A.; Supplier Part Number 2: N.A.; Component Class: Capacitors; PartId: 100200451; Author: rsk; Part number Norautron: N.A.
C24 = C0603-10µ-25V-X5R-GRM188R61E106MA73J: Capacitor, Ceramic, X5R, ±20%, 25V; Manufacturer: Murata; Part number NEMS: 100200456; Artikkelnr Noca: N.A.; Pad Count: 2; Component Status: Active; Part Number: C0603-10µ-25V-X5R-GRM188R61E106MA73J; Manufacturer Part Number: GRM188R61E106MA73J; ComponentLink1URL: https://search.murata.co.jp/Ceramy/image/img/A01X/G101/ENG/GRM188R61E106MA73-01.pdf; ComponentLink1Description: Datasheet; ComponentLink2URL: https://www.murata.com/en-global/products/productdetail?partno=GRM188R61E106MA73%23; ComponentLink2Description: Supplier link; HelpURL: N.A.; Footprint Doc: 0603; LatestRevisionDate: 2021-07-22; Published: 2020-12-16; Value: 10µF; Note: 25V; Part number IPS: N.A.; Supplier 1: Digi-Key; Supplier Part Number 1: 490-12737-1-ND; Supplier 2: Mouser; Supplier Part Number 2: 81-GRM188R61E106MA3J; Component Class: Capacitors; PartId: 100200456; Author: rsk; Part number Norautron: N.A.
C25 = C0201-1p0: Capacitor, C0G, ±0.1pF, 25V; Manufacturer: Murata; Manufacturer Part Number: GJM0335C1E1R0BB01D; Part number IPS: 00000007964; Part number NEMS: 100200398; Artikkelnr Noca: N.A.; Pad Count: 2; Component Status: Active; Part Number: C0201-1p0; ComponentLink1URL: N.A.; ComponentLink1Description: Datasheet; ComponentLink2Description: Supplier link; HelpURL: http://search.murata.co.jp/Ceramy/image/img/A01X/G101/ENG/GJM0335C1E1R0BB01-01.pdf; Footprint Doc: 0201; LatestRevisionDate: 2020-10-13; Published: 2017-09-21; Value: 1.0pF; Note: ±0.1pF; ComponentLink2URL: N.A.; Supplier 1: Digi-Key; Supplier Part Number 1: 490-11172-1-ND; Supplier 2: N.A.; Supplier Part Number 2: N.A.; Component Class: Capacitors; PartId: 100200398; Author: rsk; Part number Norautron: N.A.
C26 C27 = C0201-1.2p-HQ-Murata: Capacitor, NP0, ±0.05pF, 50V; Manufacturer: Murata; Manufacturer Part Number: GJM0335C1H1R2WB01D; Part number NEMS: 100200457; Artikkelnr Noca: N.A.; Pad Count: 2; Component Status: Active; Part Number: C0201-1.2p-HQ-Murata; ComponentLink1URL: https://search.murata.co.jp/Ceramy/image/img/A01X/G101/ENG/GJM0335C1H1R2WB01-01.pdf; ComponentLink1Description: Datasheet; ComponentLink2URL: https://www.murata.com/en-global/products/productdetail?partno=GJM0335C1H1R2WB01%23; ComponentLink2Description: Supplier link; HelpURL: N.A.; Footprint Doc: 0201; LatestRevisionDate: 2020-12-16; Published: 2020-12-16; Value: 1.2pF; Note: 50V; Part number IPS: N.A.; Supplier 1: Digi-Key; Supplier Part Number 1: 490-GJM0335C1H1R2WB01DCT-ND; Supplier 2: Mouser; Supplier Part Number 2: 81-GJM0335C1H1R2WB1D; Component Class: Capacitors; PartId: 100200457; Author: rsk; Part number Norautron: N.A.
C30 = C0201-6.8p-HQ-Murata: Capacitor, NP0, ±0.1pF, 25V; Manufacturer: Murata; Manufacturer Part Number: GJM0335C1E6R8BB01; Part number NEMS: 100200463; Artikkelnr Noca: N.A.; Pad Count: 2; Component Status: Active; Part Number: C0201-6.8p-HQ-Murata; ComponentLink1URL: N.A.; ComponentLink1Description: Datasheet; ComponentLink2URL: N.A.; ComponentLink2Description: Supplier link; HelpURL: https://psearch.en.murata.com/capacitor/product/GJM0335C1E6R8BB01%23.html; Footprint Doc: 0201; LatestRevisionDate: 2021-02-16; Published: 2021-02-16; Value: 6.8pF; Note: 25V; Supplier 1: Digi-Key; Supplier Part Number 1: 490-11183-1-ND; Supplier 2: N.A.; Supplier Part Number 2: N.A.; Part number IPS: N.A.; Component Class: Capacitors; Author: rubr; PartId: 100200463; Part number Norautron: N.A.
C31 = C0201-1.8p-HQ-Murata: Capacitor, NP0, ±0.1pF, 25V; Manufacturer: Murata; Manufacturer Part Number: GJM0335C1E1R8BB01; Part number NEMS: 100200461; Artikkelnr Noca: N.A.; Pad Count: 2; Component Status: Active; Part Number: C0201-1.8p-HQ-Murata; ComponentLink1URL: N.A.; ComponentLink1Description: Datasheet; ComponentLink2URL: N.A.; ComponentLink2Description: Supplier link; HelpURL: https://psearch.en.murata.com/capacitor/product/GJM0335C1E1R8BB01%23.html; Footprint Doc: 0201; LatestRevisionDate: 2021-02-16; Published: 2021-02-16; Value: 1.8pF; Note: 25V; Supplier 1: Digi-Key; Supplier Part Number 1: 490-8581-1-ND; Supplier 2: N.A.; Supplier Part Number 2: N.A.; Part number IPS: N.A.; Component Class: Capacitors; Author: rubr; PartId: 100200461; Part number Norautron: N.A.
C32 = C0201-9.5p-50V-NP0-GJM0335C1H9R5WB01: Capacitor, NP0, ±0.05pF, 50V, High Q; Manufacturer: Murata; Part number NEMS: 100200476; Artikkelnr Noca: N.A.; Pad Count: 2; Component Status: Active; Part Number: C0201-9.5p-50V-NP0-GJM0335C1H9R5WB01; Manufacturer Part Number: GJM0335C1H9R5WB01; ComponentLink1URL: https://no.mouser.com/datasheet/2/281/GJM0335C1H9R5WB01_01-1971631.pdf; ComponentLink1Description: Datasheet; ComponentLink2URL: N.A.; ComponentLink2Description: Supplier link; HelpURL: https://www.murata.com/en-eu/products/productdetail?partno=GJM0335C1H9R5WB01%23; Footprint Doc: 0201; LatestRevisionDate: 2021-06-11; Published: 2021-06-11; Value: 9.5pF; Note: 50V; Supplier 1: N.A.; Supplier Part Number 1: N.A.; Supplier 2: Mouser; Supplier Part Number 2: 81-GJM0335C1H9R5WB1D; Part number IPS: N.A.; Component Class: Capacitors; Author: masi; Part number Norautron: N.A.; PartId: 100200476
J1 J2 = MM8130-2600: Coaxial Connector with Switch; Manufacturer: Murata; Part number IPS: 00000009955; Part number Norautron: 26030338; Part number NEMS: 100500400; Note: N.A.; Artikkelnr Noca: 55029011; Pad Count: 3; Component Status: Active; Part Number: MM8130-2600; Manufacturer Part Number: MM8130-2600; LatestRevisionDate: 2014-04-24; Published: 2014-04-24; Value: MM8130-2600; Footprint Doc: COAXIAL-SWF; ComponentLink1URL: N.A.; ComponentLink1Description: Datasheet; ComponentLink2URL: N.A.; ComponentLink2Description: Supplier link; HelpURL: http://www.murata.com/products/catalog/pdf/o33e.pdf; Supplier 1: Digi-Key; Supplier Part Number 1: 490-4981-1-ND; Supplier 2: Mouser; Supplier Part Number 2: 81-MM8130-2600RA2; Component Class: Connectors; PartId: 100500400; Author: rsk; System: Connector
L4 L5 = L0201-1n9-HQ-Murata: Inductor, 600mA, ±0.1ｎH, 120mOhm; Manufacturer: Murata; Manufacturer Part Number: LQP03HQ1N9B02; Part number IPS: 00000004903; Part number NEMS: 100300206; Note: -55°C ~ 125°C; Artikkelnr Noca: N.A.; Pad Count: 2; Component Status: Active; Part Number: L0201-1n9-HQ-Murata; ComponentLink1URL: https://search.murata.co.jp/Ceramy/image/img/P02/JELF243C-0021.pdf; ComponentLink1Description: Datasheet; ComponentLink2Description: Supplier link; HelpURL: https://psearch.en.murata.com/inductor/product/LQP03HQ1N9B02%23.html; Footprint Doc: 0201; LatestRevisionDate: 2018-10-23; Published: 2018-10-23; Value: 1.9nH; ComponentLink2URL: N.A.; Supplier 1: Digi-Key; Supplier Part Number 1: 490-13889-1-ND; Supplier 2: N.A.; Supplier Part Number 2: N.A.; Component Class: Inductors; PartId: 100300206; Author: rsk; Part number Norautron: N.A.
L6 = L0201-1n8-HQ-Murata: Inductor, 800mA, ±0.1ｎH, 80mOhm; Manufacturer: Murata; Manufacturer Part Number: LQP03HQ1N8B02; Part number NEMS: 100300205; Note: -55°C ~ 125°C; Artikkelnr Noca: N.A.; Pad Count: 2; Component Status: Active; Part Number: L0201-1n8-HQ-Murata; ComponentLink1URL: https://search.murata.co.jp/Ceramy/image/img/P02/JELF243C-0021.pdf; ComponentLink1Description: Datasheet; ComponentLink2URL: N.A.; ComponentLink2Description: Supplier link; HelpURL: https://psearch.en.murata.com/inductor/product/LQP03HQ1N8B02%23.html; Footprint Doc: 0201; LatestRevisionDate: 2018-10-23; Published: 2018-10-23; Value: 1.8nH; Supplier 1: Digi-Key; Supplier Part Number 1: 490-13887-1-ND; Supplier 2: N.A.; Supplier Part Number 2: N.A.; Part number IPS: N.A.; Component Class: Inductors; PartId: 100300205; Author: rsk; Part number Norautron: N.A.
L7 = L0201-N.C.: Not mounted; Manufacturer: N.A.; Part number NEMS: 100300001; Assembly: Not mounted; Pad Count: 2; Component Status: Active; Part Number: L0201-N.C.; Manufacturer Part Number: N.A.; ComponentLink1URL: N.A.; ComponentLink1Description: Datasheet; ComponentLink2URL: N.A.; ComponentLink2Description: Supplier link; HelpURL: N.A.; Footprint Doc: 0201; LatestRevisionDate: 2013-04-10; Published: 2013-04-10; Value: N.C.; Note: N.A.; Supplier 1: N.A.; Supplier Part Number 1: N.A.; Supplier 2: N.A.; Supplier Part Number 2: N.A.; Artikkelnr Noca: N.A.; Part number IPS: N.A.; Component Class: Inductors; PartId: 100300001; Author: rsk; Part number Norautron: N.A.
R2 = R0402-49R9_0.1%: Resistor, ±1%, 0.063W; Manufacturer: Panasonic; Manufacturer Part Number: ERA-2AEB49R9X; Part number NEMS: 100100141; Pad Count: 2; Note: Chip Res 1%; Artikkelnr Noca: N.A.; Component Status: Active; Part Number: R0402-49R9_0.1%; PartId: 100100141; Component Class: Resistors; Author: rsk; ComponentLink1URL: N.A.; ComponentLink1Description: Datasheet; ComponentLink2URL: N.A.; ComponentLink2Description: Supplier link; HelpURL: N.A.; Footprint Doc: 0402; LatestRevisionDate: 2017-08-15; Published: 2017-08-15; Value: 49R9; Supplier 1: Digi-Key; Supplier Part Number 1: P49.9DCCT-ND; Supplier 2: N.A.; Supplier Part Number 2: N.A.; Part number IPS: N.A.; Part number Norautron: N.A.
R5 = R0201-0R: Resistor, ±5%, 0.05W; Manufacturer: N.A.; Part number IPS: 00000003245; Part number NEMS: 100100001; Note: Chip Res 5%; Pad Count: 2; Component Status: Active; Part Number: R0201-0R; Manufacturer Part Number: N.A.; ComponentLink1URL: N.A.; ComponentLink1Description: Datasheet; ComponentLink2URL: N.A.; ComponentLink2Description: Supplier link; HelpURL: N.A.; Footprint Doc: 0201; LatestRevisionDate: 2017-11-09; Published: 2014-11-13; Value: 0R; Supplier 1: N.A.; Supplier Part Number 1: N.A.; Supplier 2: N.A.; Supplier Part Number 2: N.A.; Artikkelnr Noca: N.A.; Component Class: Resistors; PartId: 100100001; Author: rsk; Part number Norautron: N.A.
R6 = R0201-33k: Resistor, ±1%, 0.05W; Manufacturer: N.A.; Part number IPS: 00000001708; Part number NEMS: 100100073; Pad Count: 2; Note: Chip Res 1%; Component Status: Active; Part Number: R0201-33k; PartId: 100100073; Component Class: Resistors; Author: rsk; Manufacturer Part Number: N.A.; ComponentLink1URL: N.A.; ComponentLink1Description: Datasheet; ComponentLink2URL: N.A.; ComponentLink2Description: Supplier link; HelpURL: N.A.; Footprint Doc: 0201; LatestRevisionDate: 2014-11-13; Published: 2014-11-13; Value: 33k; Supplier 1: N.A.; Supplier Part Number 1: N.A.; Supplier 2: N.A.; Supplier Part Number 2: N.A.; Artikkelnr Noca: N.A.; Part number Norautron: N.A.
SB6 = Solderbridge Shorted: as SB1 on sheet pca20053_sheet5_sensors_and_leds; Part Number: Solderbridge Shorted; PartId: 100500459; Component Class: Connectors; Manufacturer Part Number: N.A.; ComponentLink1URL: N.A.; ComponentLink1Description: Datasheet; ComponentLink2URL: N.A.; ComponentLink2Description: Supplier link; HelpURL: N.A.; Footprint Doc: Solderbridge_Shorted; LatestRevisionDate: 2012-08-07; Published: 2012-08-07; Value: Solderbridge; Note: N.A.; Supplier 1: N.A.; Supplier Part Number 1: N.A.; Supplier 2: N.A.; Supplier Part Number 2: N.A.; Artikkelnr Noca: N.A.; Part number IPS: N.A.; Author: rsk; Part number Norautron: N.A.
TP43 = TP_SMD_Ø1.5MM: 1.5mm circular SMD testpad; Manufacturer: Nordic Semiconductor; Manufacturer Part Number: N.A.; Part number NEMS: 100500477; Pad Count: 1; Component Status: Active; System: Connector; Part Number: TP_SMD_Ø1.5MM; PartId: 100500477; Component Class: Connectors; ComponentLink1URL: N.A.; ComponentLink1Description: Datasheet; ComponentLink2URL: N.A.; ComponentLink2Description: Supplier link; HelpURL: N.A.; Footprint Doc: TP_SMD_Ø1.5mm; LatestRevisionDate: 2021-03-05; Published: 2016-06-02; Value: Ø1.5mm,SMD; Note: N.A.; Supplier 1: N.A.; Supplier Part Number 1: N.A.; Supplier 2: N.A.; Supplier Part Number 2: N.A.; Artikkelnr Noca: N.A.; Part number IPS: N.A.; Author: rsk; Part number Norautron: N.A.
U2 = nRF21540-QDAAG0: Radio front-end / range extender for 2.4GHz; Manufacturer: Nordic Semiconductor; Part number NEMS: 102000223; Pad Count: 16; Note: N.A.; Component Status: Active; Part Number: nRF21540-QDAAG0; Component Class: nRF_Devices; Manufacturer Part Number: nRF21540-QDAAG00; ComponentLink1URL: N.A.; ComponentLink1Description: Datasheet; ComponentLink2URL: N.A.; ComponentLink2Description: Supplier link; HelpURL: N.A.; Footprint Doc: QFN-16; LatestRevisionDate: 2021-03-24; Published: 2021-03-24; Value: nRF21540-QDAAG00; Supplier 1: Nordic Semiconductor; Supplier Part Number 1: nRF21540-QDAAG00; Supplier 2: N.A.; Supplier Part Number 2: N.A.; Artikkelnr Noca: N.A.; Part number IPS: N.A.; Author: hany; Part number Norautron: N.A.; PartId: 102000223
U17 = PE4259G-06SC70: SPDT High Power UltraCMOS® 10 MHz–3.0 GHz RF Switch; Manufacturer: pSemi; Manufacturer Part Number: 4259-63; Part number NEMS: 101900641; Pad Count: 6; Note: N.A.; Component Status: Active; Part Number: PE4259G-06SC70; Component Class: Misc_ICs; ComponentLink1URL: https://www.psemi.com/pdf/datasheets/pe4259ds.pdf; ComponentLink1Description: Datasheet; ComponentLink2URL: https://www.digikey.com/en/products/detail/psemi/4259-63/2614473; ComponentLink2Description: Supplier link; HelpURL: N.A.; Footprint Doc: SC70-6; LatestRevisionDate: 2021-01-08; Published: 2021-01-08; Value: PE4259; Supplier 1: Digi-Key; Supplier Part Number 1: 1046-1011-1-ND; Supplier 2: N.A.; Supplier Part Number 2: N.A.; Artikkelnr Noca: N.A.; Part number IPS: N.A.; PartId: 101900641; Author: rsk; Part number Norautron: N.A.